# EAGLE design v2 (EAGLE 8.5.1)

## Sheet 1 of 2
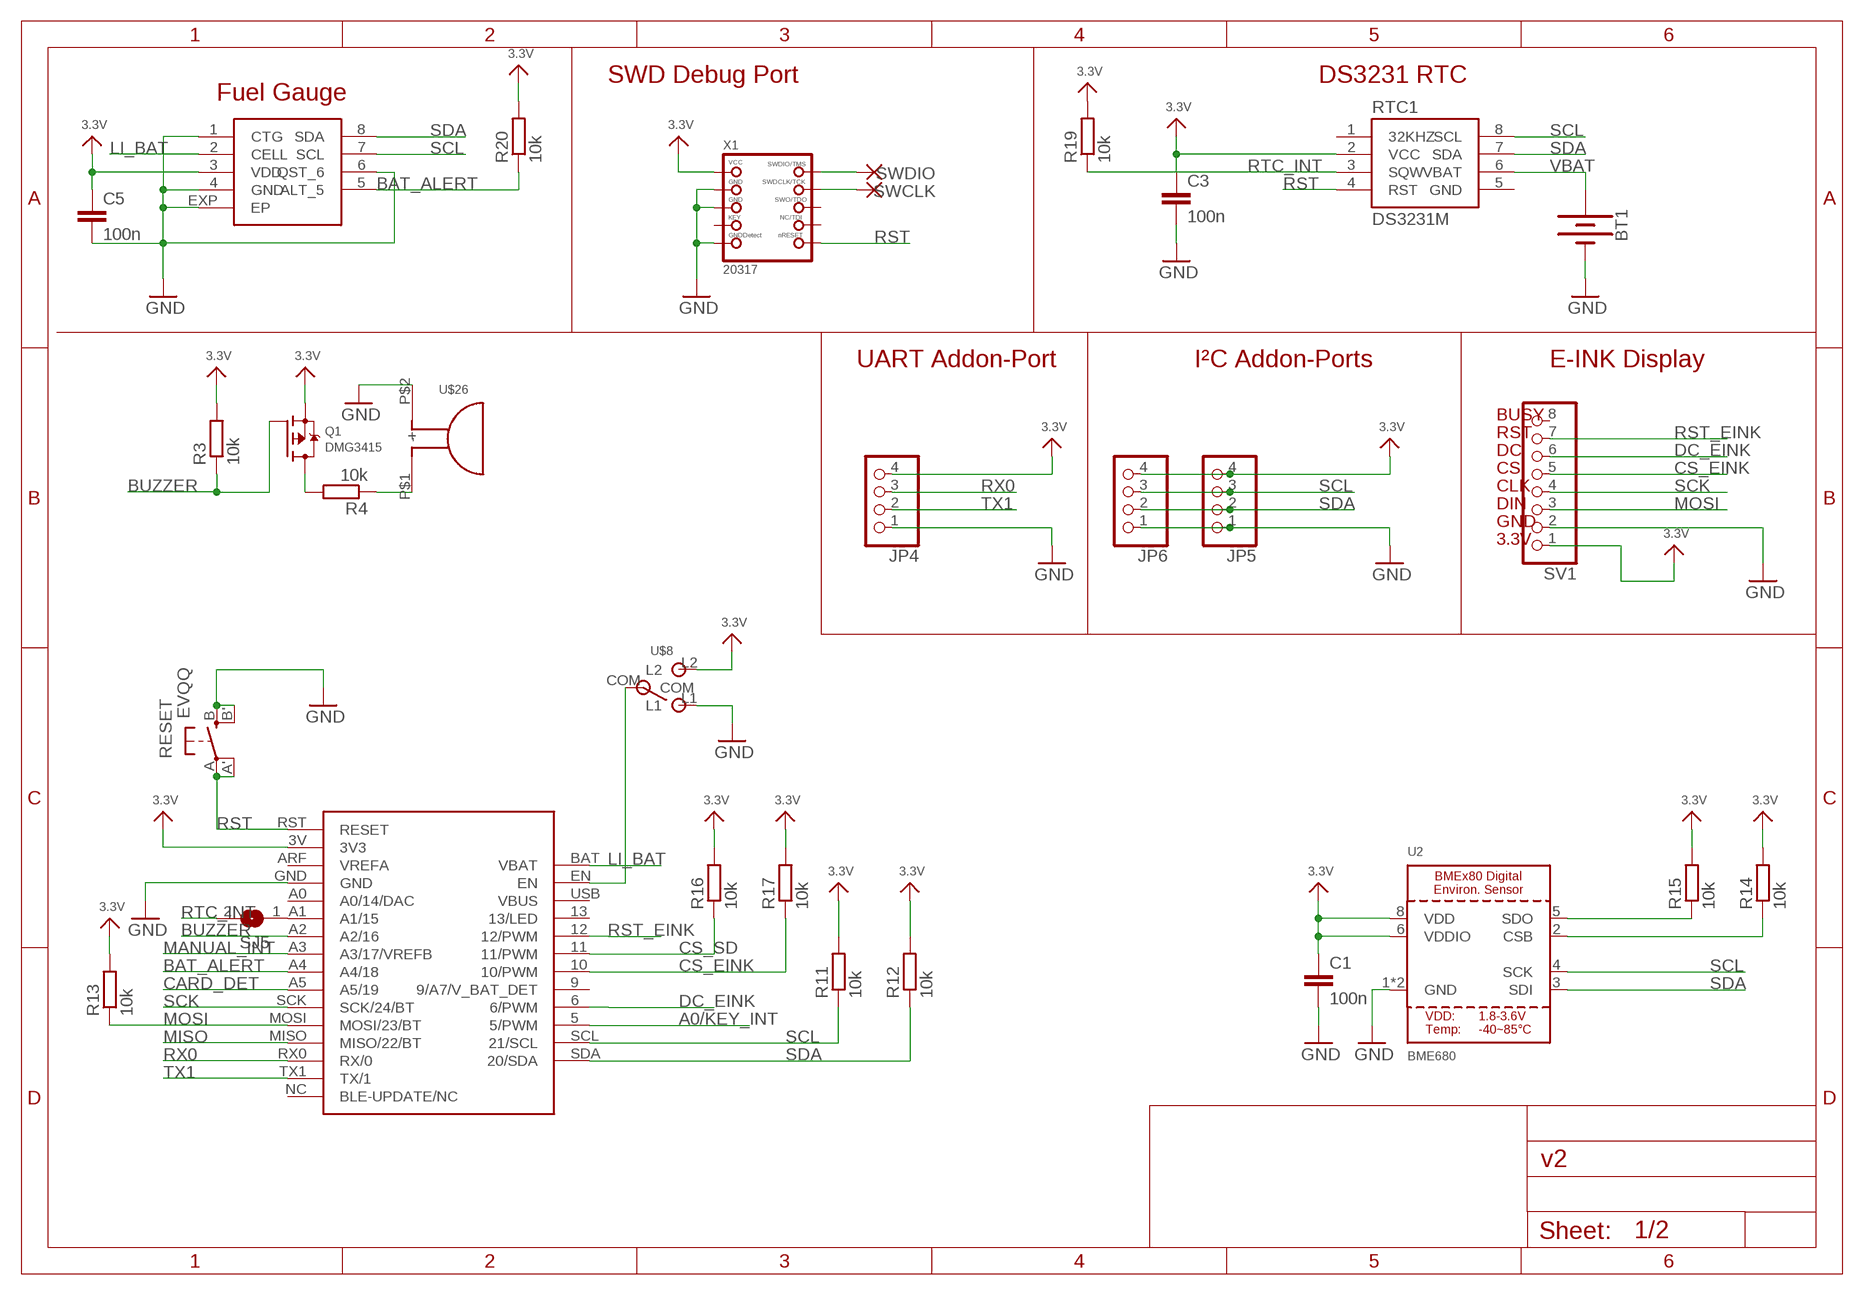
[diagram p0: schematic, sheet 1]

### Parts
BT1  BATTERY-12MM_SMD  [BATTCON_12MM]
C1  100n  C-EUC0805  [C0805]
C3  100n  C-EUC0805  [C0805]
C5  100n  C-EUC0805  [C0805]
JP4  PINHD-1X04_2.54  [1X04]
JP5  PINHD-1X04_2.54  [1X04]
JP6  PINHD-1X04_2.54  [1X04]
Q1  DMG3415  MOSFET-PWIDE  [SOT23-WIDE]
R3  10k  R-EU_R0805  [R0805]
R4  10k  R-EU_R0805  [R0805]
R11  10k  R-EU_R0805  [R0805]
R12  10k  R-EU_R0805  [R0805]
R13  10k  R-EU_R0805  [R0805]
R14  10k  R-EU_R0805  [R0805]
R15  10k  R-EU_R0805  [R0805]
R16  10k  R-EU_R0805  [R0805]
R17  10k  R-EU_R0805  [R0805]
R19  10k  R-EU_R0805  [R0805]
R20  10k  R-EU_R0805  [R0805]
RESET  EVQQ  SPST_TACT-EVQQ2  [EVQ-Q2]
RTC1  DS3231M  [SO08]
SJ5  SOLDERJUMPERCLOSED  [SOLDERJUMPER_CLOSEDWIRE]
SV1  PINHD-1X08_2.54  [1X08]
SWCLK  WIREPADSMD1,27-254  [SMD1,27-2,54]
SWDIO  WIREPADSMD1,27-254  [SMD1,27-2,54]
U2  BME680  BME280  [BME280]
U$8  MSK-12C02_SMD_SPDT_SWITCH  [MSK-12C02]
U$15  FEATHER_M0  [FEATHER_M0]
U$26  DTS402G1  [DET402G1]
U$33  MAX17043  [DFN-2X3]
X1  20317  JTAG-CORTEXBOXPOSTS  [2X05_1.27MM_BOX_POSTS]

### Nets
3.3V: C1.1 C3.1 C5.1 JP4.4 JP5.4 JP6.4 Q1.2(S) R3.2 R11.2 R12.2 R13.2 R14.2 R15.2 R16.2 R17.2 R19.2 R20.2 RTC1.2(VCC) SV1.1 U2.6(VDDIO) U2.8(VDD) U$8.L2 U$15.3V(3V3) U$33.3(VDD) X1.1(VCC) ; also sheet 2
A0/KEY_INT: U$15.5(5/PWM) ; also sheet 2
BAT_ALERT: R20.1 U$15.A4(A4/18) U$33.5(ALT_5)
BUZZER: Q1.1(G) R3.1 U$15.A2(A2/16)
CARD_DET: U$15.A5(A5/19) ; also sheet 2
CS_EINK: R17.1 SV1.5 U$15.10(10/PWM)
CS_SD: R16.1 U$15.11(11/PWM) ; also sheet 2
DC_EINK: SV1.6 U$15.6(6/PWM)
EN: U$8.COM U$15.EN
GND: BT1.GND(-) C1.2 C3.2 C5.2 JP4.1 JP5.1 JP6.1 RESET.B'(S1) RESET.B(S) SV1.2 U2.1(GND) U2.7(GND) U$8.L1 U$15.GND U$26.P$2(-) U$33.1(CTG) U$33.4(GND) U$33.6(QST_6) U$33.EXP(EP) X1.3(GND) X1.5(GND) X1.9(GNDDETECT) ; also sheet 2
LI_BAT: U$15.BAT(VBAT) U$33.2(CELL)
MANUAL_INT: U$15.A3(A3/17/VREFB) ; also sheet 2
MISO: U$15.MISO(MISO/22/BT) ; also sheet 2
MOSI: R13.1 SV1.3 U$15.MOSI(MOSI/23/BT) ; also sheet 2
N$5: R14.1 U2.2(CSB)
N$6: SJ5.1 U$15.A1(A1/15)
N$8: Q1.3(D) R4.2
N$9: R4.1 U$26.P$1(+)
N$12: R15.1 U2.5(SDO)
N$14: SWDIO.1(P) X1.2(SWDIO)
N$15: SWCLK.1(P) X1.4(SWDCLK)
RST: RESET.A'(P1) RESET.A(P) RTC1.4(RST) U$15.RST(RESET) X1.10(NRESET)
RST_EINK: SV1.7 U$15.12(12/PWM)
RTC_INT: R19.1 RTC1.3(SQW) SJ5.2
RX0: JP4.3 U$15.RX0(RX/0)
SCK: SV1.4 U$15.SCK(SCK/24/BT) ; also sheet 2
SCL: JP5.3 JP6.3 R11.1 RTC1.8(SCL) U2.4(SCK) U$15.SCL(21/SCL) U$33.7(SCL) ; also sheet 2
SDA: JP5.2 JP6.2 R12.1 RTC1.7(SDA) U2.3(SDI) U$15.SDA(20/SDA) U$33.8(SDA) ; also sheet 2
TX1: JP4.2 U$15.TX1(TX/1)
VBAT: BT1.PWR@1(+) RTC1.6(VBAT)
Unconnected: RTC1.1(32KHZ) SV1.8 U$15.9(9/A7/V_BAT_DET) U$15.13(13/LED) U$15.A0(A0/14/DAC) U$15.ARF(VREFA) U$15.NC(BLE-UPDATE/NC) U$15.USB(VBUS) X1.6(SWO) X1.7(KEY) X1.8(TDI)

### Notes on the sheet
- SWD Debug Port | DS3231 RTC
- Fuel Gauge
- UART Addon-Port | I²C Addon-Ports | E-INK Display
- BUSY
- RST
- DC
- CS
- CLK
- DIN
- GND
- 3.3V

## Sheet 2 of 2
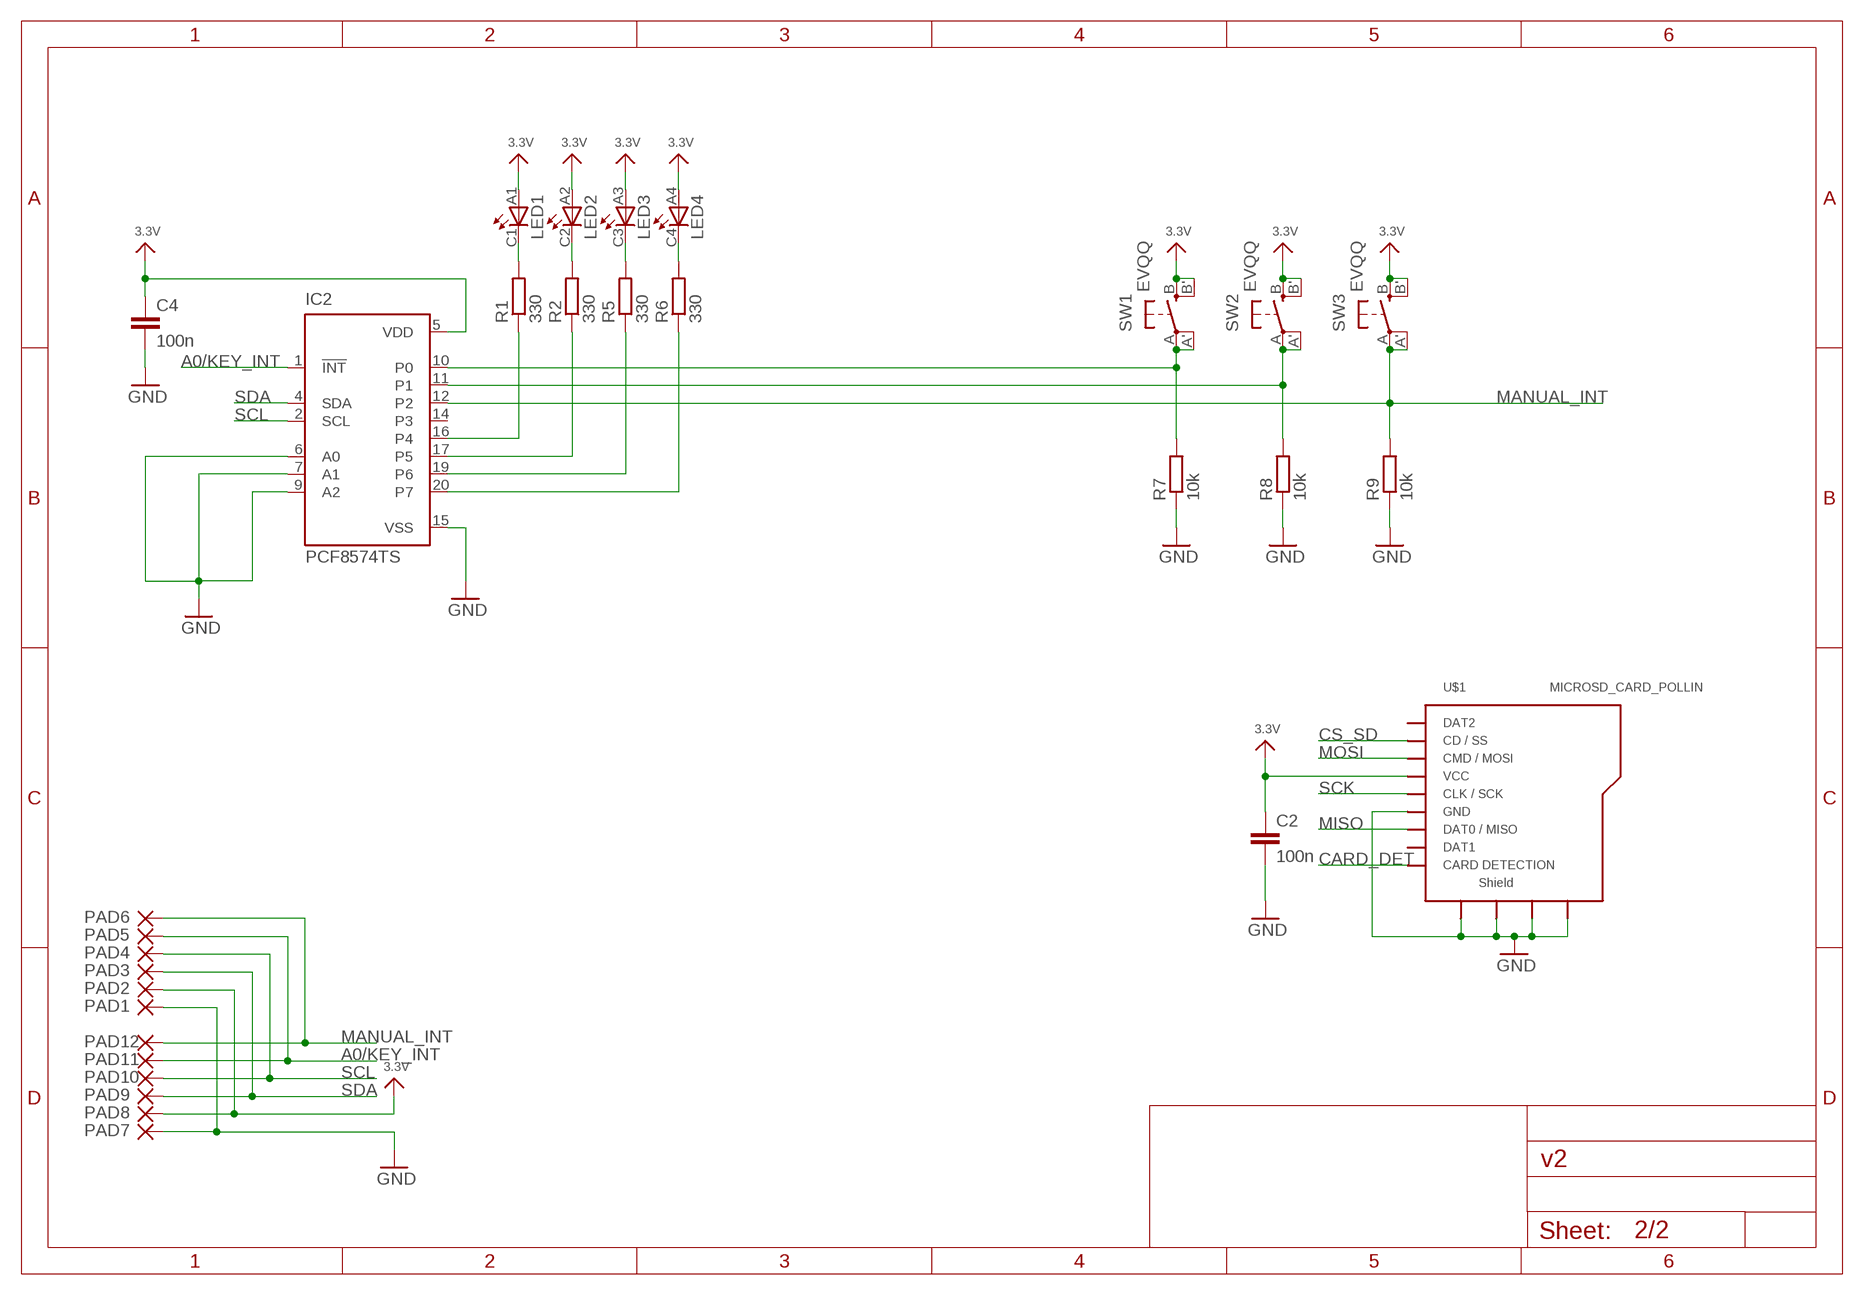
[diagram p1: schematic, sheet 2]

### Parts
C2  100n  C-EUC0805  [C0805]
C4  100n  C-EUC0805  [C0805]
IC2  PCF8574TS  [SSOP20]
PAD1  WIREPADSMD1,27-254  [SMD1,27-2,54]
PAD2  WIREPADSMD1,27-254  [SMD1,27-2,54]
PAD3  WIREPADSMD1,27-254  [SMD1,27-2,54]
PAD4  WIREPADSMD1,27-254  [SMD1,27-2,54]
PAD5  WIREPADSMD1,27-254  [SMD1,27-2,54]
PAD6  WIREPADSMD1,27-254  [SMD1,27-2,54]
PAD7  WIREPADSMD1,27-254  [SMD1,27-2,54]
PAD8  WIREPADSMD1,27-254  [SMD1,27-2,54]
PAD9  WIREPADSMD1,27-254  [SMD1,27-2,54]
PAD10  WIREPADSMD1,27-254  [SMD1,27-2,54]
PAD11  WIREPADSMD1,27-254  [SMD1,27-2,54]
PAD12  WIREPADSMD1,27-254  [SMD1,27-2,54]
R1  330  R-EU_R0805  [R0805]
R2  330  R-EU_R0805  [R0805]
R5  330  R-EU_R0805  [R0805]
R6  330  R-EU_R0805  [R0805]
R7  10k  R-EU_R0805  [R0805]
R8  10k  R-EU_R0805  [R0805]
R9  10k  R-EU_R0805  [R0805]
SW1  EVQQ  SPST_TACT-EVQQ2  [EVQ-Q2]
SW2  EVQQ  SPST_TACT-EVQQ2  [EVQ-Q2]
SW3  EVQQ  SPST_TACT-EVQQ2  [EVQ-Q2]
U$1  MICROSD_CARD_POLLIN  [MR**-AP*03**]
U$5  LED_LIGHTGUIDE  [LPA-C041301S-X]

### Nets
3.3V: C2.1 C4.1 IC2.5(VDD) PAD2.1(P) PAD8.1(P) SW1.B'(S1) SW1.B(S) SW2.B'(S1) SW2.B(S) SW3.B'(S1) SW3.B(S) U$1.VCC U$5.A1 U$5.A2 U$5.A3 U$5.A4 ; also sheet 1
A0/KEY_INT: IC2.1(!INT) PAD5.1(P) PAD11.1(P) ; also sheet 1
CARD_DET: U$1.CARD_DETECTION(CARD_D) ; also sheet 1
CS_SD: U$1.DAT3/CS(CD/SS) ; also sheet 1
GND: C2.2 C4.2 IC2.6(A0) IC2.7(A1) IC2.9(A2) IC2.15(VSS) PAD1.1(P) PAD7.1(P) R7.1 R8.1 R9.1 U$1.GND U$1.SHD_1(SHD1) U$1.SHD_2(SHD2) U$1.SHD_3(SHD3) U$1.SHD_4(SHD4) ; also sheet 1
MANUAL_INT: IC2.12(P2) PAD6.1(P) PAD12.1(P) R9.2 SW3.A'(P1) SW3.A(P) ; also sheet 1
MISO: U$1.DAT0(DAT0/MISO) ; also sheet 1
MOSI: U$1.CMD(CMD/MOSI) ; also sheet 1
N$1: IC2.16(P4) R1.1
N$2: IC2.17(P5) R2.1
N$3: IC2.10(P0) R7.2 SW1.A'(P1) SW1.A(P)
N$4: IC2.11(P1) R8.2 SW2.A'(P1) SW2.A(P)
N$10: IC2.19(P6) R5.1
N$11: IC2.20(P7) R6.1
N$13: R6.2 U$5.C4
N$16: R5.2 U$5.C3
N$17: R2.2 U$5.C2
N$18: R1.2 U$5.C1
SCK: U$1.CLK(CLK/SCK) ; also sheet 1
SCL: IC2.2(SCL) PAD4.1(P) PAD10.1(P) ; also sheet 1
SDA: IC2.4(SDA) PAD3.1(P) PAD9.1(P) ; also sheet 1
Unconnected: IC2.14(P3) U$1.DAT1 U$1.DAT2

## Power pins joined to a net without a drawn wire
GND: RTC1.5(GND)

## Library data of the parts
BT1 = SparkFun-Batteries:BATTERY: Battery - Single Cell A variety of battery chemistries, sizes, and footprints. Device List: 20MM_PTH - Coin Cell Battery Holder - 20mm (PTH) <https://www.sparkfun.com/products/783> 6.8MM_PTH - Coin Cell Battery Holder - 6.8MM(SMD) <https://www.digikey.com/product-detail/en/seiko-instruments/MS621FE-FL11E/728-1057-ND/1889208?WT.srch=1&gclid=CNOQ5a6LzdQCFZS2wAodXCkE0g> 12MM_SMD - Coin Cell Battery Holder - 12mm (SMD) <https://www.sparkfun.com/products/10592> 12MM_PTH - Coin Cell Battery Holder - 12mm (PTH) <https://www.sparkfun.com/products/7948> 20MM_SMD - 20mm Coin Cell Battery Holder (SMD) (2 legs) Used on the Big Time Watch Kit <https://www.sparkfun.com/products/11734> 20MM_SMD_4LEGS - Coin Cell Battery Holder - 20mm (SMD) <https://www.sparkfun.com/products/11892> 20MM_SMD_4LEGS_OVERPASTE - Coin Cell Battery Holder - 20mm (SMD) <https://www.sparkfun.com/products/11892> (Over-paste on the legs) 24.5MM_PTH - Coin Cell Battery Holder - 24.5mm (PTH) <https://www.sparkfun.com/products/8863> 9V - 9V Battery Holder - PC Mount Used on the SparkFun SparkPunk Sound Kit <https://www.sparkfun.com/products/11177> and SparkFun SparkPunk Sequencer Kit <https://www.sparkfun.com/products/12707> 18650 - Battery Holder - 18650 (PTH) <https://www.sparkfun.com/products/13113> AA - Battery Holder - 1xAA (PTH) <https://www.sparkfun.com/products/7949> AAA - Battery Holder - 1xAAA (PTH) <https://www.sparkfun.com/products/12718> AA_KIT - Battery Holder - 1xAA (PTH) <https://www.sparkfun.com/products/7949> Special kit package - pads only have exposed copper on one side of the board. AAA_KIT - Battery Holder - 1xAAA (PTH) <https://www.sparkfun.com/products/12718> Special kit package - pads only have exposed copper on one side of the board.; PROD_ID: BATT-08044; SF_SKU: PRT-10592
C1-C5 = rcl:C-EU: CAPACITOR, European symbol
IC2 = micro-philips:PCF8574: I2C-Bus Remote 8-bit I/O expander http://www.semiconductors.philips.com/acrobat_download/datasheets/PCF8574_4.pdf; MPN: PCF8574TS/3,118; OC_FARNELL: 1506644; OC_NEWARK: 70R6873
JP4-JP6 = pinhead-2:PINHD-1X04: PIN HEADER
PAD1-PAD12 SWCLK SWDIO = wirepad:WIREPAD: Wire PAD connect wire on PCB
Q1 = microbuilder:MOSFET-P: P-Channel Mosfet LEGEND VDS: Voltage Drain-Source ID: Drain Current RDS(ON): Drain-Source On-State Resistance VGS(TH): Gate-Source Threshold Voltage CISS: Drain-Source Input Capacitance SOT-23 Name VDS ID RDS(ON) VGS(TH) CISS Order Number IRLML5103 30V 760mA 600 mOhm -- 75pF @ 25V Digikey: IRLML5103PBFCT-ND IRLML6401 12V 4.3A 50 mOhm 950mV @ 250µA 830pF @ 10V Digikey: IRLML6401PBFTR-ND NTR0202PL 20V 400mA 800 mOhm 2.3V @ 250uA 70pF @ 5V Digikey: NTR0202PLT1GOSTR-ND NTR4101PT1G 20V 1.8A 85 mOhm 1.2V @ 250uA 675pF @ 10V Digikey: NTR4101PT1GOSCT-ND DMP2004K 20V 600mA 900 mOhm 1V @ 250uA 175pF @ 16V Digikey: DMP2004KDICT-ND PMV65XP 20V 3.9A 76 mOhm 950mV @ 1mA 725pF @ 20V Digikey: 568-2358-2-ND TO-252 Name VDS ID RDS(ON) VGS(TH) CISS Order Number AOD417 30V 25A 34 mOhm 3V @ 250µA 920pF @ 15V Digikey: 785-1106-2-ND
R1-R9 R11-R17 R19 R20 = rcl:R-EU_: RESISTOR, European symbol
RESET SW1-SW3 = adafruit:SPST_TACT: SMT 6mm switch, EVQQ2 series http://www.ladyada.net/library/eagle
RTC1 = SparkFun-Clocks:DS3231M: DS3231M Real Time Clock Accuracy +/-5ppm. Battery Backup. 2.3V to 5.5V. Datasheet <https://cdn.sparkfun.com/datasheets/Dev/Beagle/DS3231M.pdf> SparkFun Products CryptoCape <https://www.sparkfun.com/products/12773> (DEV-12773) SparkFun CryptoShield <https://www.sparkfun.com/products/13183> (DEV-13183); PROD_ID: IC-11985
SJ5 = microbuilder:SOLDERJUMPER: SMD Solder JUMPER Solder the two pads together to create a connection, or remove the solder to break it. REFLOW - Use this footprint for solder paste and reflow ovens. WAVE - Use this footprint for hand-soldering (larger pads). CLOSED - Has a trace between the two pads to ensure it is closed by default. The trace needs to be cut to disable the jumper, and can be closed again by creating a solder bridge between the two pads.
SV1 = pinhead-2:PINHD-1X08: PIN HEADER
U2 = microbuilder:BME280: BME280 - Environmental Sensor (I2C + SPI)
U$1 = 000_eigene_Bauteile:MICROSD_CARD_POLLIN
U$5 = 000_Simons_Eigene:LED_LIGHTGUIDE
U$8 = 000_Simons_Eigene:MSK-12C02_SMD_SPDT_SWITCH: Footprint of the VIMEX MSK-12C02 SPDT SMD Switch Created by mzst on 17-Jan-2016
U$15 = 000_Simons_Eigene:FEATHER_M0
U$26 = 000_Simons_Eigene:DTS402G1
U$33 = MAX17043:MAX17043
X1 = microbuilder:JTAG-CORTEX: Serial Wire (SW-DP) Connector Standard 0.05" 10-pin connector is for use with the Cortex M and Cortex A SWD (serial wire debugger) interface (SW-DP) Connectors 2x05_1.27MM_SMT - Inexpensive surface-mount header with bare pins, compatible with standard 10-pin SWD cables (4UCON: 16846) 2x05_1.27MM_BOX_NOPOSTS - Polarised surface-mount box (4UCON with caps: 19735, without caps: 15117 2x05_1.27MM_BOX_POSTS - Polarised surface-mount box with mounting holes (4UCON: 20317) Pinout: http://infocenter.arm.com/help/topic/com.arm.doc.faqs/attached/13634/cortex_debug_connectors.pdf http://www.keil.com/peripherals/coresight/connectors.asp

## Board
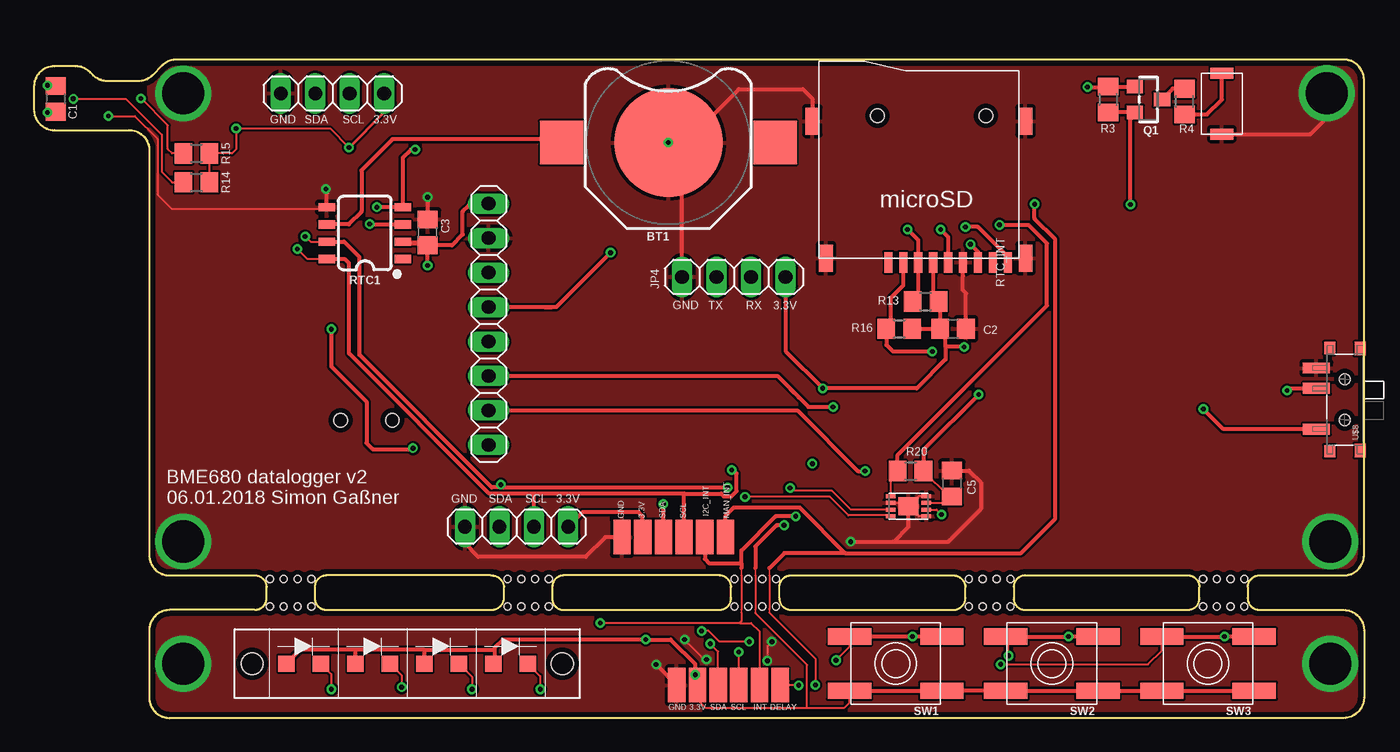
[diagram p2: board, top side]
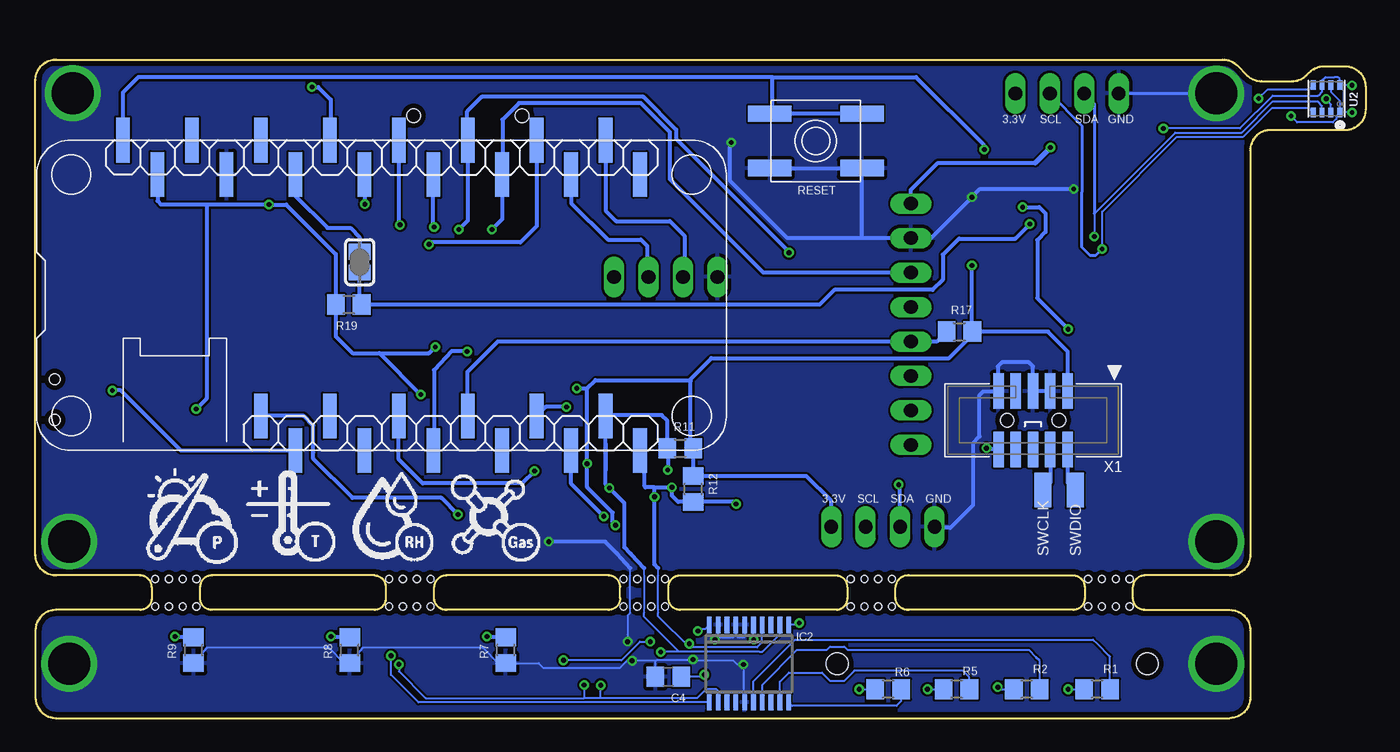
[diagram p3: board, bottom side, seen from below]

Size 98 x 48.5 mm. Coordinates in mm from the lower left corner, seen from the top.
Outline: 96.5,48.5 10.52,48.5 arc45 9.46,48.06 8.74,47.34 arc-45 7.68,46.9 5.42,46.9 arc-45 4.36,47.34 4.14,47.56 arc45 3.08,48 1.5,48 arc90 0,46.5 0,44.8 arc90 1.5,43.3 7,43.3 arc-90 8.5,41.8 8.5,12 arc90 10,10.5 16.27,10.5 arc-90 17.14,9.64 17.14,8.82 arc-90 16.27,7.96 10,7.96 arc90 8.5,6.46 8.5,1.5 arc90 10,0 96.5,0 arc90 98,1.5 98,6.46 arc90 96.5,7.96 90.3,7.96 arc-90 89.43,8.82 89.43,9.64 arc-90 90.3,10.5 96.5,10.5 arc90 98,12 98,47 arc90 96.5,48.5
Outline: 21.56,10.5 arc90 20.69,9.64 20.69,8.82 arc90 21.56,7.96 33.65,7.96 arc90 34.64,8.82 34.64,9.64 arc90 33.65,10.5 21.56,10.5
Outline: 85.01,10.5 arc-90 85.88,9.64 85.88,8.82 arc-90 85.01,7.96 73.02,7.96 arc-90 72.19,8.82 72.19,9.64 arc-90 73.02,10.5 85.01,10.5
Outline: 50.5,7.96 arc90 51.36,8.82 51.36,9.64 arc90 50.5,10.5 39,10.5 arc90 38.19,9.64 38.19,8.82 arc90 38.98,7.96 50.5,7.96
Outline: 54.92,8.82 54.92,9.64 arc-90 55.78,10.5 67.68,10.5 arc-90 68.64,9.64 68.64,8.82 arc-90 67.68,7.96 55.78,7.96 arc-90 54.92,8.82
Copper layers (1*16): Top 0.0356mm / dielectric 1.5011mm / Bottom 0.0356mm
Design rules "oshpark-2layer *": minimum track width 6mil, minimum drill 13mil, track to track 6mil, track to pad 6mil, pad to pad 6mil, via to via 6mil, smd to smd 6mil, copper to edge 15mil, drill to drill 6mil, minimum pad ring 7mil, minimum via ring 7mil, stop-mask expansion 2.5mil, vias tented up to drill 14mil, thermal gap 10mil
Holes 0.51 mm at 17.39,10.25 18.41,10.25 19.42,10.25 20.44,10.25 17.39,8.21 18.41,8.21 19.42,8.21 20.44,8.21 86.13,10.25 87.15,10.25 88.16,10.25 89.18,10.25 86.13,8.21 87.15,8.21 88.16,8.21 89.18,8.21 51.62,10.25 52.63,10.25 53.65,10.25 54.67,10.25 51.62,8.21 52.63,8.21 53.65,8.21 54.67,8.21 34.89,10.25 35.91,10.25 36.92,10.25 37.94,10.25 34.89,8.21 35.91,8.21 36.92,8.21 37.94,8.21 68.89,10.25 69.91,10.25 70.92,10.25 71.94,10.25 68.89,8.21 69.91,8.21 70.92,8.21 71.94,8.21

### Footprints (pad centres in the part's own frame; a part is rotated, then mirrored left to right if it is on the bottom)
BATTCON_12MM = smd 8 x 8: GND 0,0 | smd 3.175 x 3.175: PWR@1 -7.874,0; PWR@2 7.874,0
C0805 = smd 1.3 x 1.5: 1 -0.95,0; 2 0.95,0
SSOP20 = smd 0.35 x 1.2: 1 -2.925,-2.85; 2 -2.275,-2.85; 3 -1.625,-2.85; 4 -0.975,-2.85; 5 -0.325,-2.85; 6 0.325,-2.85; 7 0.975,-2.85; 8 1.625,-2.85; 9 2.275,-2.85; 10 2.925,-2.85; 11 2.925,2.85; 12 2.275,2.85; 13 1.625,2.85; 14 0.975,2.85; 15 0.325,2.85; 16 -0.325,2.85; 17 -0.975,2.85; 18 -1.625,2.85; 19 -2.275,2.85; 20 -2.925,2.85
1X04 = drill 1.016 long: 1 -3.81,0; 2 -1.27,0; 3 1.27,0; 4 3.81,0
SMD1,27-2,54 = smd 1.27 x 2.54: 1 0,0
SOT23-WIDE = smd 1 x 1.2: 1 -0.95,-1; 2 0.95,-1; 3 0,1
R0805 = smd 1.3 x 1.5: 1 -0.95,0; 2 0.95,0
EVQ-Q2 = smd 3.2 x 1.2: A -3.4,-2; A' 3.4,-2; B -3.4,2; B' 3.4,2
SO08 = smd 0.6 x 1.2: 1 -1.905,-2.8; 2 -0.635,-2.8; 3 0.635,-2.8; 4 1.905,-2.8; 5 1.905,2.8; 6 0.635,2.8; 7 -0.635,2.8; 8 -1.905,2.8
SOLDERJUMPER_CLOSEDWIRE = smd 1.168 x 1.6: 1 -0.762,0; 2 0.762,0 | smd 0.635 x 0.203: WIRE 0,0
1X08 = drill 1.016 long: 1 -8.89,0; 2 -6.35,0; 3 -3.81,0; 4 -1.27,0; 5 1.27,0; 6 3.81,0; 7 6.35,0; 8 8.89,0
BME280 = smd 0.7 x 0.35: 1 1.025,0.975; 2 1.025,0.325; 3 1.025,-0.325; 4 1.025,-0.975; 5 -1.025,-0.975; 6 -1.025,-0.325; 7 -1.025,0.325; 8 -1.025,0.975
MR**-AP*03** = smd 0.6 x 1.5: CARD_DETECTION -6.55,0.3; CLK -2.15,0.3; CMD 0.05,0.3; DAT0 -4.35,0.3; DAT1 -5.45,0.3; DAT2 2.25,0.3; DAT3/CS 1.15,0.3; GND -3.25,0.3; VCC -1.05,0.3 | smd 1 x 2: SHD_1 -7.85,0; SHD_2 6.85,0; SHD_3 -7.85,-10.1; SHD_4 7.85,-10.1 | hole 1: -4.95,-10.5; 3.05,-10.5
LPA-C041301S-X = smd 1.2 x 1.2: A1 -8.89,0; A2 -3.81,0; A3 1.27,0; A4 6.35,0; C1 -6.35,0; C2 -1.27,0; C3 3.81,0; C4 8.89,0 | hole 1.6: 11.43,0; -11.43,0
MSK-12C02 = smd 0.8 x 2: COM 0.823,2.1; L1 2.323,2.1; L2 -2.177,2.1 | smd 1 x 0.8: GND@1 -3.75,-1.125; GND@4 3.75,-1.125 | smd 0.9 x 0.8: GND@2 -3.8,1.125; GND@3 3.8,1.125 | hole 0.8: -1.5,0; 1.5,0
FEATHER_M0 = smd 1.016 x 3.302 bottom: 3V -16.51,-9.525; 5 13.97,10.795; 6 11.43,8.255; 9 8.89,10.795; 10 6.35,8.255; 11 3.81,10.795; 12 1.27,8.255; 13 -1.27,10.795; A0 -8.89,-12.065; A1 -6.35,-9.525; A2 -3.81,-12.065; A3 -1.27,-9.525; A4 1.27,-12.065; A5 3.81,-9.525; ARF -13.97,-12.065; BAT -8.89,8.255; EN -6.35,10.795; GND -11.43,-9.525; MISO 11.43,-12.065; MOSI 8.89,-9.525; NC 19.05,-9.525; RST -19.05,-12.065; RX0 13.97,-9.525; SCK 6.35,-12.065; SCL 16.51,8.255; SDA 19.05,10.795; TX1 16.51,-12.065; USB -3.81,8.255
DET402G1 = smd 1.676 x 0.813: P$1 0,2.25; P$2 0,-2.25
DFN-2X3 = smd 0.7 x 0.3: 1 -1.325,0.75; 2 -1.325,0.25; 3 -1.325,-0.25; 4 -1.325,-0.75; 5 1.325,-0.75; 6 1.325,-0.25; 7 1.325,0.25; 8 1.325,0.75 | smd 1.5 x 1.3: EXP 0,0
2X05_1.27MM_BOX_POSTS = smd 0.76 x 2.6: 1 -2.54,-2.15; 2 -2.54,2.15; 3 -1.27,-2.15; 4 -1.27,2.15; 5 0,-2.15; 6 0,2.15; 7 1.27,-2.15; 8 1.27,2.15; 9 2.54,-2.15; 10 2.54,2.15 | hole 1: -1.905,0; 1.905,0

### Placement (x,y rotation side)
BT1  46.74,42.39 0 top
C1  1.6,45.6 270 top
C2  67.72,28.67 0 top
C3  29.01,35.77 90 top
C4  51.38,3.03 180 bottom
C5  67.63,17.27 90 top
IC2  45.42,4 180 bottom
JP4  51.56,32.48 0 top
JP5  35.56,14.09 0 top
JP6  22,46 0 top
PAD1  43.33,13.33 0 top
PAD2  44.86,13.33 0 top
PAD3  46.38,13.33 0 top
PAD4  47.9,13.33 0 top
PAD5  49.43,13.33 0 top
PAD6  50.95,13.33 0 top
PAD7  47.36,2.42 0 top
PAD8  48.89,2.42 0 top
PAD9  50.41,2.42 0 top
PAD10  51.93,2.42 0 top
PAD11  53.46,2.42 0 top
PAD12  54.98,2.42 0 top
Q1  82.11,45.55 270 top
R1  19.78,2.12 180 bottom
R2  24.96,2.12 180 bottom
R3  79.15,45.55 270 top
R4  84.79,45.4 90 top
R5  30.14,2.12 180 bottom
R6  35.17,2.12 180 bottom
R7  63.35,5 90 bottom
R8  74.85,5 90 bottom
R9  86.35,5 90 bottom
R11  50.5,19.86 0 bottom
R12  49.53,16.87 90 bottom
R13  65.7,30.68 0 top
R14  11.98,39.46 0 top
R15  11.98,41.59 0 top
R16  63.75,28.67 0 top
R17  29.92,28.45 0 bottom
R19  74.92,30.45 180 bottom
R20  64.58,18.19 0 top
RESET  40.5,42.5 180 bottom
RTC1  24.38,35.72 90 top
SJ5  74.12,33.58 270 bottom
SV1  33.5,29 270 top
SW1  63.5,4 180 top
SW2  75,4 180 top
SW3  86.5,4 180 top
SWCLK  23.78,16.79 0 bottom
SWDIO  21.39,16.79 0 bottom
U2  2.88,45.6 270 bottom
U$1  65.2,33.86 180 top
U$5  27.5,4 0 top
U$8  96.59,23.45 90 top
U$14  GASLOGO45MM  [BME680_LOGO_30MM]  90.25,10.96 0 bottom
U$15  72.5,30.5 180 top
U$26  87.53,45.25 0 top
U$33  64.43,15.6 180 top
X1  24.5,21.93 180 bottom

### Tracks (layer width: path | path; a pad name or v marks a point on that pad's centre or on a via)
3.3V  (via drill 0.35)
  Top 0.102: 53.15,7.76 53.15,8 | 53.15,11.03 53.15,10.5
  Top 0.152: 45.38,5.62 45.23,5.62 v45.08,5.78 | 53.15,7.76 53.15,7.72 56.96,3.92 56.96,0.75 | 53.15,10.5 53.15,8 | v48.73,3.18 PAD8.1 48.89,1.97 48.73,1.81 48.73,1.51 49.5,0.75 56.96,0.75 | U$33.3 67.16,15.85 C5.1 67.4,16.32 R20.2 | C1.1 1.05,46.55 v1,46.6 | v23.22,42.02 21.81,43.42 v14.9,43.42 14.9,41.89 14.6,41.59 R15.2 R14.2 | 56.96,0.75 59.71,0.75 60.1,1.14 SW1.B'
  Top 0.203: JP6.4 25.81,44.61 v23.22,42.02
  Top 0.305: SW3.B SW3.B' SW2.B SW2.B' SW1.B SW1.B' | v29.01,33.33 C3.1 30.8,34.82 31.6,35.62 31.6,37.32 32.05,37.78 34.39,37.78 SV1.1 | R16.2 C2.1 | C2.1 66.77,30.57 R13.2 66.25,31.08 U$1.VCC 66.27,32.57 | PAD2.1 44.86,14.85 44.55,15.16 40.44,15.16 JP5.4 | v55.27,14.2 54.72,14.2 53.15,12.63 53.15,11.03 | v48.73,3.18 48.73,3.95 46.91,5.78 v45.08,5.78 34.56,5.78 33.95,5.17 33.95,5.01 | v58.12,24.28 58.27,24.28 | C2.1 67.17,28.27 67.17,27.33 | 67.17,27.33 67.17,26.42 65.04,24.28 v58.12,24.28 | v68.55,27.33 67.17,27.33 | JP4.4 55.37,27.03 v58.12,24.28 | v69.61,23.83 65.53,19.75 R20.2 | 33.95,5.01 33.95,4.1 U$5.A4 | 23.74,5.01 19.62,5.01 U$5.A1 | 28.77,5.01 23.74,5.01 | 28.77,5.01 33.95,5.01 | U$5.A2 23.69,4.96 23.74,5.01 | U$5.A3 28.77,5.01 | R3.2 Q1.2 80.79,44.13 v80.79,37.82 | U$8.L2 87.64,21.28 v86.16,22.76
  Top 0.381: RTC1.2 27.25,35.01 28.55,35.01 28.74,34.82 C3.1
  Bottom 0.152: IC2.5 45.1,5.8 v45.08,5.78 | v48.73,3.18 49.04,3.04 C4.1 | v1,46.6 1.88,46.6 U2.8 1.91,47.07 2.04,47.2 2.29,47.2 2.29,47.21 2.96,47.21 3.21,46.96 U2.6 3.21,46.12 3.49,45.83 6.85,45.83 9.26,43.42 v14.9,43.42
  Bottom 0.305: U$15.3V 89.01,38.08 88.75,37.82 86.83,37.82 | 86.83,37.82 86.81,37.82 | 85.39,37.82 v80.79,37.82 79.52,37.82 75.87,34.17 R19.2 75.87,28.1 74.64,26.87 72.66,26.87 | R11.2 49.69,19.83 | v55.27,14.2 55.48,14.4 55.48,15.12 57.35,17 v57.35,18.73 57.35,24.28 | R11.2 49.53,19.85 R12.2 41.2,17.82 39.37,15.99 JP5.4 | v58.12,24.28 57.35,24.28 | 57.35,24.28 56.74,24.89 49.8,24.89 | R11.2 49.73,20.05 49.73,24.83 49.8,24.89 | 24.34,40.89 31.5,40.89 33.5,38.89 SV1.1 | 85.39,37.82 85.39,23.52 v86.16,22.76 | 29.01,28.49 v29.01,33.33 | 29.01,28.49 R17.2 23.41,28.45 21.96,27.01 | 29.01,28.49 29.01,28.18 30.68,26.5 48.19,26.5 49.8,24.89 | 21.96,27.01 | 72.66,26.87 69,26.87 v68.55,27.33 | 72.66,26.87 v69.61,23.83 | 21.96,27.01 X1.1 | 85.39,37.82 86.83,37.82
  Bottom 0.381: v23.22,42.02 24.34,40.89
A0/KEY_INT  (via drill 0.35)
  Top 0.102: 52.12,11.03 52.12,10.5 | 52.12,7.98 52.12,7.76
  Top 0.152: 52.01,7 52.85,7 53.46,6.38 PAD11.1 | 52.01,7 v41.72,7 | 51.97,7 52.01,7.03 | 52.12,7.76 52.12,7.15 52.01,7.03 | 52.12,10.5 52.12,7.98 | 52.01,7.03 52.01,7
  Top 0.305: v56.13,14.85 54.65,14.85 52.12,12.33 52.12,11.41 | PAD5.1 49.43,11.72 49.73,11.41 52.12,11.41 | 52.12,11.41 52.12,11.03
  Bottom 0.152: IC2.1 41.86,6.85 v41.72,7
  Bottom 0.305: U$15.5 58.53,17.25 v56.13,14.85
BAT_ALERT  (via drill 0.35)
  Top 0.152: R20.1 63.11,17.66 U$33.5
  Top 0.305: v71.14,36.32 73.27,36.32 74.64,34.95 74.64,30.38 63.63,19.37 R20.1
  Bottom 0.305: U$15.A4 71.23,36.42 v71.14,36.32
BUZZER  (via drill 0.35)
  Top 0.305: 79.67,46.5 Q1.1 | 79.67,46.5 R3.1 | v77.62,46.47 79.64,46.47 79.67,46.5
  Bottom 0.305: v77.62,46.47 77.17,46.47 76.25,45.55 76.25,42.62 U$15.A2
CARD_DET  (via drill 0.35)
  Top 0.305: U$1.CARD_DETECTION 71.75,33.96 69.55,36.17 v68.63,36.17
  Bottom 0.305: v68.63,36.17 68.69,36.11 U$15.A5
CS_EINK
  Bottom 0.305: U$15.10 66.19,22.29 66.19,25.47 63.94,27.73 SV1.5 | 33.8,27.73 SV1.5 | R17.1 31.6,27.73 SV1.5
CS_SD  (via drill 0.35)
  Top 0.305: v66.19,27 63.3,27 62.8,27.49 R16.1 63.15,29.01 63.15,30.96 64.05,31.87 U$1.DAT3/CS
  Bottom 0.305: U$15.11 68.63,19.76 68.63,25.62 67.33,27.03 66.22,27.03 v66.19,27
DC_EINK  (via drill 0.35)
  Top 0.305: 56.35,23.61 55.77,24.19 | 56.35,23.61 57.05,22.91 v58.88,22.91 | SV1.6 54.77,25.19 56.35,23.61
  Bottom 0.305: 61.16,22.34 U$15.6 60.4,22.91 v58.88,22.91
EN  (via drill 0.35)
  Top 0.305: v92.32,24.13 92.47,24.28 U$8.COM
  Bottom 0.305: U$15.EN 87.28,19.7 91.71,24.13 v92.32,24.13
GND  (via drill 0.35, 3.1)
  Top 0.152: v47.94,5.78 49.41,4.31 v49.55,4.31 | v54.37,5.62 54.04,5.29 v54.04,4.22 | U$33.6 64.18,15.85 U$33.EXP | U$33.4 65.18,16.35 U$33.EXP | U$33.1 65.18,14.85 U$33.EXP | C1.2 1.05,44.65 v1,44.6 | RTC1.5 21.43,37.48 10.18,37.48 9.11,38.54 9.11,42.66 7.43,44.34 v5.5,44.34
  Top 0.305: RTC1.5 21.57,38.66 | v29.01,38.36 C3.2 | 48.12,41.39 BT1.GND | JP4.1 47.75,40.37 BT1.GND | C2.2 68.67,31.28 68.45,31.49 68.45,32.56 U$1.GND | U$26.P$2 94.03,43 95.37,44.33 95.37,45.89 v95.24,46.02 | U$33.EXP 64.43,14.07 63.34,12.99 | v45.84,3.95 PAD7.1 | PAD1.1 42.11,13.33 40.66,11.87 32.73,11.87 31.75,12.85 JP5.1 | v60.17,12.99 63.34,12.99 | C5.2 68.9,18.22 69.77,17.36 69.77,15.38 67.37,12.99 63.34,12.99 | BT1.GND 48.01,42.39 51.93,46.31 56.66,46.31 57.35,45.62 U$1.SHD_4
  Top 0.381: 21.57,38.66 v21.52,38.97
  Bottom 0.102: 54.18,7.72 54.18,7.74 | 54.18,11.03 54.18,10.5 | 54.18,7.76 54.18,8.06
  Bottom 0.152: IC2.15 45.68,1.22 45.84,1.38 v45.84,3.95 46.3,3.95 46.6,4.25 49.5,4.25 v49.55,4.31 49.8,4.25 52.24,4.25 | IC2.9 47.7,6.11 47.67,6.08 | 47.67,6.08 47.51,5.93 46.6,5.93 46.4,6.13 | 46.4,6.13 IC2.7 | IC2.6 45.75,6.02 45.84,5.93 46.2,5.93 46.4,6.13 | 86.75,4.05 R9.1 85.38,5.17 76.37,5.17 75.26,4.05 R8.1 73.88,5.17 65.03,5.17 63.92,4.05 R7.1 60.93,4.05 60.55,3.67 54.95,3.67 54.37,4.25 54.01,4.25 | v47.94,5.78 47.67,6.05 47.67,6.08 | 54.01,4.25 52.24,4.25 | C4.2 52.33,4.17 52.24,4.25 | 54.18,7.76 54.18,7.72 54.37,7.53 v54.37,5.62 | 54.18,8.06 54.18,10.5 | U2.7 2.56,46.12 1.89,45.45 1.89,44.59 U2.1 | U2.1 2.16,44.33 2.16,44.13 2.41,43.88 5.04,43.88 v5.5,44.34 | v54.04,4.22 54.01,4.25 | v1,44.6 1.89,44.6 U2.1
  Bottom 0.203: JP6.1 v11,46
  Bottom 0.305: v60.17,12.99 56.02,12.99 55.18,12.15 54.18,11.03 | v21.52,38.97 28.4,38.97 v29.01,38.36 32.02,35.35 SV1.2 37.15,35.35 | BT1.GND 46.84,42.29 46.84,39.58 42.61,35.35 37.15,35.35 | RESET.B' RESET.B 37.15,40.45 37.15,35.35 | JP5.1 31.66,14 30.6,14 28.92,15.68 28.92,20.25 28.44,20.74 28.44,23.78 28.16,24.06 27.06,24.06 X1.9 27.09,24.13 27.09,25.89 26.79,26.2 24.81,26.2 24.5,25.89 X1.5 X1.3
  Bottom 0.381: U$15.GND
  other vias: 95.5,13 95.5,4 11,13 11,4 46.74,42.39
  pour Top: 8.5,48.42 98.01,48.42 98.01,0 8.5,0
  pour Bottom: 8.5,48.42 98.01,48.42 98.01,0 8.5,0
LI_BAT  (via drill 0.35)
  Top 0.152: U$33.2 66.51,15.35 v66.87,14.99
  Bottom 0.305: v66.87,14.99 68.09,16.21 74.64,16.21 77.54,19.1 77.54,19.56 77.54,21.54 78.24,22.24 U$15.BAT
MANUAL_INT  (via drill 0.35)
  Top 0.102: 54.18,8.02 54.18,7.76 | 54.18,11.03 54.18,10.5
  Top 0.15: 83.1,5.01 SW3.A'
  Top 0.152: 54.18,10.5 54.18,8.02 | v71.22,3.95 v71.23,3.95 82.08,3.95 83.1,4.97 83.1,5.01 | v57.57,2.42 57.57,4.37 54.18,7.76 | v56.35,2.41 56.34,2.42 PAD12.1
  Top 0.305: 59.77,12.15 56.41,15.51 55.86,15.51 51.56,15.51 50.95,14.9 PAD6.1 | 54.18,11.03 55.3,12.15 59.77,12.15 | v73.73,37.85 73.73,36.78 75.25,35.26 75.25,14.68 72.72,12.15 59.77,12.15 | SW3.A' v87.71,6 SW3.A
  Bottom 0.152: 86.55,6 R9.2 | IC2.12 47.7,2 47.82,2.12 48.58,2.12 49.24,1.46 56.35,1.46 | v71.22,3.95 71.22,3.43 69.25,1.46 57.57,1.46 | 56.35,1.46 57.57,1.46 | v57.57,2.42 57.57,1.46 | 56.35,1.46 v56.35,2.41
  Bottom 0.305: v73.73,37.85 73.73,39.37 73.77,39.41 U$15.A3 | v87.71,6 86.55,6
MISO  (via drill 0.35)
  Top 0.305: 69.55,33.69 U$1.DAT0 69.55,34.33 v69,34.88
  Bottom 0.305: U$15.MISO 61.07,36.23 62.27,35.04 68.85,35.04 v69,34.88
MOSI  (via drill 0.35)
  Top 0.305: 64.9,35.45 v64.36,35.99 65.15,35.2 U$1.CMD 65.15,31.09 R13.1 64.9,30.83
  Bottom 0.305: v64.36,35.99 63.61,36.74 U$15.MOSI 63.6,40.03 63.6,44.07 62.38,45.28 53.39,45.28 51.26,43.15 51.26,39.69 44.37,32.81 SV1.3
N$1
  Bottom 0.152: IC2.16 45.1,2.7 42.03,5.78 20.08,5.78 19.78,5.47 | 19.78,5.47 18.9,4.59 | R1.1 18.83,4.52 19.78,5.47
N$2
  Bottom 0.152: IC2.17 44.45,2.44 41.88,5.01 39.69,5.01 39.45,5.26 38.41,5.26 38.17,5.01 24.81,5.01 24.27,4.48 | 24.27,4.48 24.05,4.25 | R2.1 24.01,4.22 24.27,4.48
N$3  (via drill 0.35)
  Top 0.152: v52.7,5.62 50.5,5.62 49.71,6.41 v49.19,6.41 | SW1.A' 60.1,5.25 v59.1,4.25
  Top 0.305: SW1.A v64.73,6 SW1.A'
  Bottom 0.152: 63.55,6 R7.2 | IC2.10 48.67,6.54 48.89,6.54 49.01,6.41 v49.19,6.41 | v52.7,5.62 53.46,5.62 54.83,4.25 v59.1,4.25
  Bottom 0.305: v64.73,6 63.55,6
N$4  (via drill 0.35)
  Top 0.152: 71.8,5.88 SW2.A' 71.8,5.8 v71.8,4.58
  Top 0.305: SW2.A' v76.22,6 SW2.A
  Bottom 0.152: 75.05,6 R8.2 | v71.8,4.58 71.8,3.18 69.77,1.15 IC2.11
  Bottom 0.305: v76.22,6 75.05,6
N$5  (via drill 0.35)
  Top 0.152: R14.1 10.18,39.46 9.41,40.22 9.41,42.96 6.77,45.6 v2.9,45.6
  Bottom 0.152: U2.2 2.56,45.2 2.88,45.53 2.88,45.59 v2.9,45.6
N$6
  Bottom 0.305: U$15.A1 78.85,38.46 76.49,36.1 74.79,36.1 74.12,35.43 SJ5.1
N$8
  Top 0.305: R4.2 83.91,46.35 Q1.3
N$9
  Top 0.305: R4.1 86.43,44.45 87.53,45.55 U$26.P$1
N$10
  Bottom 0.152: IC2.19 43.15,2.67 42.48,3.34 40.05,3.34 39.45,2.74 38.41,2.74 37.66,3.49 29.68,3.49 29.19,3 R5.1
N$11
  Bottom 0.152: R6.1 34.22,1.24 34.56,0.9 42.24,0.9 IC2.20
N$12  (via drill 0.35)
  Top 0.152: v7.89,45.63 9.87,43.65 9.87,41.89 10.18,41.59 R15.1
  Bottom 0.152: U2.5 4.2,46.29 7.23,46.29 v7.89,45.63
N$13  (via drill 0.35)
  Top 0.152: U$5.C4 37.3,3.09 v37.3,2.12
  Bottom 0.152: v37.3,2.12 R6.2
N$14
  Bottom 0.305: X1.2 21.96,17.36 SWDIO.1
N$15
  Bottom 0.305: X1.4 23.23,17.34 SWCLK.1
N$16  (via drill 0.35)
  Top 0.152: U$5.C3 32.27,3.04 v32.27,2.12
  Bottom 0.152: v32.27,2.12 R5.2
N$17  (via drill 0.35)
  Top 0.152: U$5.C2 27.09,3.14 v27.09,2.27
  Bottom 0.152: v27.09,2.27 26.94,2.12 R2.2
N$18  (via drill 0.35)
  Top 0.152: U$5.C1 21.91,3.24 v21.91,2.12
  Bottom 0.152: v21.91,2.12 R1.2
RST  (via drill 0.35)
  Top 0.305: v28.09,41.86 27.79,41.86 27.18,41.25 RTC1.4 v25.26,37.63 | v27.93,19.87 27.86,19.8 24.96,19.8 24.5,20.25 24.5,23.3 21.91,25.89 v21.91,28.64
  Bottom 0.305: v28.09,41.86 28.09,42.17 33.12,47.2 43.7,47.2 | 43.7,47.2 86.22,47.2 86.77,47.2 90.42,47.2 91.56,46.06 91.56,43.57 U$15.RST | v25.26,37.63 24.05,37.63 23.59,37.17 23.59,35.8 24.2,35.19 24.2,30.92 v21.91,28.64 | RESET.A RESET.A' 43.7,44.6 43.7,47.2 | X1.10 27.84,19.78 v27.93,19.87
RST_EINK  (via drill 0.35)
  Top 0.305: 33.54,22.69 SV1.7 56.24,22.65 60.71,18.19 v61.23,18.19
  Bottom 0.305: U$15.12 71.23,19.04 69.46,17.27 62.15,17.27 v61.23,18.19
RTC_INT  (via drill 0.35)
  Top 0.305: v24.74,36.38 27.15,36.38 RTC1.3
  Bottom 0.305: v24.74,36.38 25.81,35.31 29.95,35.31 31.14,34.12 31.14,32.29 31.9,31.53 39.13,31.53 40.22,30.45 R19.1 74.12,30.6 SJ5.2
RX0
  Bottom 0.305: U$15.RX0 58.53,37.93 55.83,35.23 53.39,35.23 52.93,34.77 52.93,32.28 JP4.3
SCK  (via drill 0.35)
  Top 0.305: v66.8,35.99 67.35,35.44 U$1.CLK | 37.61,30.27 SV1.4 | 37.61,30.27 38.18,30.27 | v42.48,34.27 38.48,30.27 37.61,30.27
  Bottom 0.305: v66.8,35.99 66.15,36.64 66.15,42.39 66.19,42.43 66.19,42.57 | 66.19,42.57 66.19,44.67 65.13,45.74 53.2,45.74 50.8,43.34 50.8,42.66 42.48,34.34 v42.48,34.27 | U$15.SCK 66.19,42.57
SCL  (via drill 0.35)
  Top 0.152: v19.41,34.55 20.15,33.81 RTC1.8 | PAD10.1 v51.93,4.86 | U$33.7 60.19,15.35 58.79,16.75 55.9,16.75 v55.71,16.93
  Top 0.305: RTC1.8 22.89,33.81 23.22,33.48 23.22,26.86 33.54,16.53 36.78,16.53 | v51.41,18.27 51.69,18.07 51.76,18.02 51.76,16.71 51.38,16.33 50.83,16.33 50.63,16.53 47.91,16.53 | 47.91,16.53 36.78,16.53 | JP5.3 36.83,16.48 36.78,16.53 | PAD4.1 47.91,16.53
  Bottom 0.076: 53.15,7.98 53.15,8.06
  Bottom 0.102: 53.15,11.03 53.15,10.5 | 53.15,7.76 53.15,7.98
  Bottom 0.15: 44.67,4.89 44.44,4.89
  Bottom 0.152: 44.67,4.89 50.59,4.89 | 50.59,4.89 53.15,7.45 53.15,7.76 | 50.59,4.89 51.91,4.89 v51.93,4.86 | 53.15,10.5 53.15,8.06 | U2.4 4.2,44.92 6.9,44.92 9.01,42.81 13.89,42.81 19.41,37.29 v19.41,34.55 | 44.44,4.89 43.15,6.18 IC2.2
  Bottom 0.203: JP6.3 20.91,43.64 20.91,38.72 20.93,38.7 20.93,34.7 20.32,34.09 19.86,34.09 v19.41,34.55
  Bottom 0.305: 53.15,11.03 54.15,12.11 54.61,12.57 54.61,15.83 v55.71,16.93 55.99,17.21 U$15.SCL | U$15.SCL 55.96,18.27 55.98,18.29 | v51.41,18.27 51.41,19.83 R11.1 51.45,21.88 51.87,22.3 55.93,22.3 U$15.SCL
SDA  (via drill 0.35)
  Top 0.152: v19.99,35.46 20.37,35.08 RTC1.7 | PAD9.1 50.41,4.89 v49.83,5.47 | U$33.8 63.03,14.92 60.01,14.92 58.64,16.29 v52.39,16.29
  Top 0.305: RTC1.7 22.84,35.08 23.98,33.94 23.98,26.74 33.73,16.99 34.56,16.99 | 34.56,16.99 v51.1,16.99 | PAD3.1 v46.38,15.77 | v34.41,17.19 34.56,17.03 34.56,16.99
  Bottom 0.102: 52.12,10.5 52.12,11.04 | 52.12,7.76 52.12,7.98
  Bottom 0.152: IC2.4 44.49,6.81 44.49,5.54 44.84,5.19 49.83,5.19 | 49.83,5.19 v49.83,5.47 | 49.83,5.19 52.12,7.49 52.12,7.76 | 52.12,7.98 52.12,10.5 | U2.3 3.21,45.09 3.49,45.38 6.87,45.38 9.14,43.11 14.02,43.11 19.99,37.14 v19.99,35.46
  Bottom 0.203: JP6.2 19.99,45.26 19.99,37.14
  Bottom 0.305: v51.1,16.99 51.04,16.92 | U$15.SDA 53.12,19.38 53.12,17.05 53.06,16.99 52.39,16.99 | 52.39,16.99 v51.1,16.99 | 52.12,11.04 52.39,11.31 v52.39,16.29 52.39,16.99 | v46.38,15.77 46.53,15.92 R12.1 50.65,15.92 51.1,16.38 v51.1,16.99 | v34.41,17.19 34.29,17.07 JP5.2
TX1
  Bottom 0.305: U$15.TX1 55.99,37.37 55.22,36.6 51.26,36.6 50.19,35.53 50.19,32.28 JP4.2
VBAT
  Top 0.305: RTC1.6 23.19,36.35 24.13,37.29 24.13,40.34 26.42,42.63 38.63,42.63 BT1.PWR@1 39.1,42.39 | 39.1,42.39 39.67,42.96 | 39.1,42.39 39.07,42.35 39.07,41.74

### Text on the board
tPlace: GND | SDA | SCL | 3.3V | TX | RX | 3.3V | BME680 datalogger v2 / 06.01.2018 Simon Gaßner | GND | SDA | SCL | 3.3V | GND | 3.3V | SDA | SCL | I2C_INT | MAN_INT | GND | 3.3V | SDA | SCL | INT | DELAY
tNames: RTC_INT | GND
bNames: GND | SDA | SCL | 3.3V | GND | SDA | SCL | 3.3V